# EasyEDA Pro project ProPrj_nrf52833_LighthouseTag_2025-07-28.epro, schematic Schematic4
Create Date: 2025-05-14; Page Name: P1; Project Name: Magnetic robot_hkust_bi; Schematic Name: Schematic4; Update Date: 2025-05-18
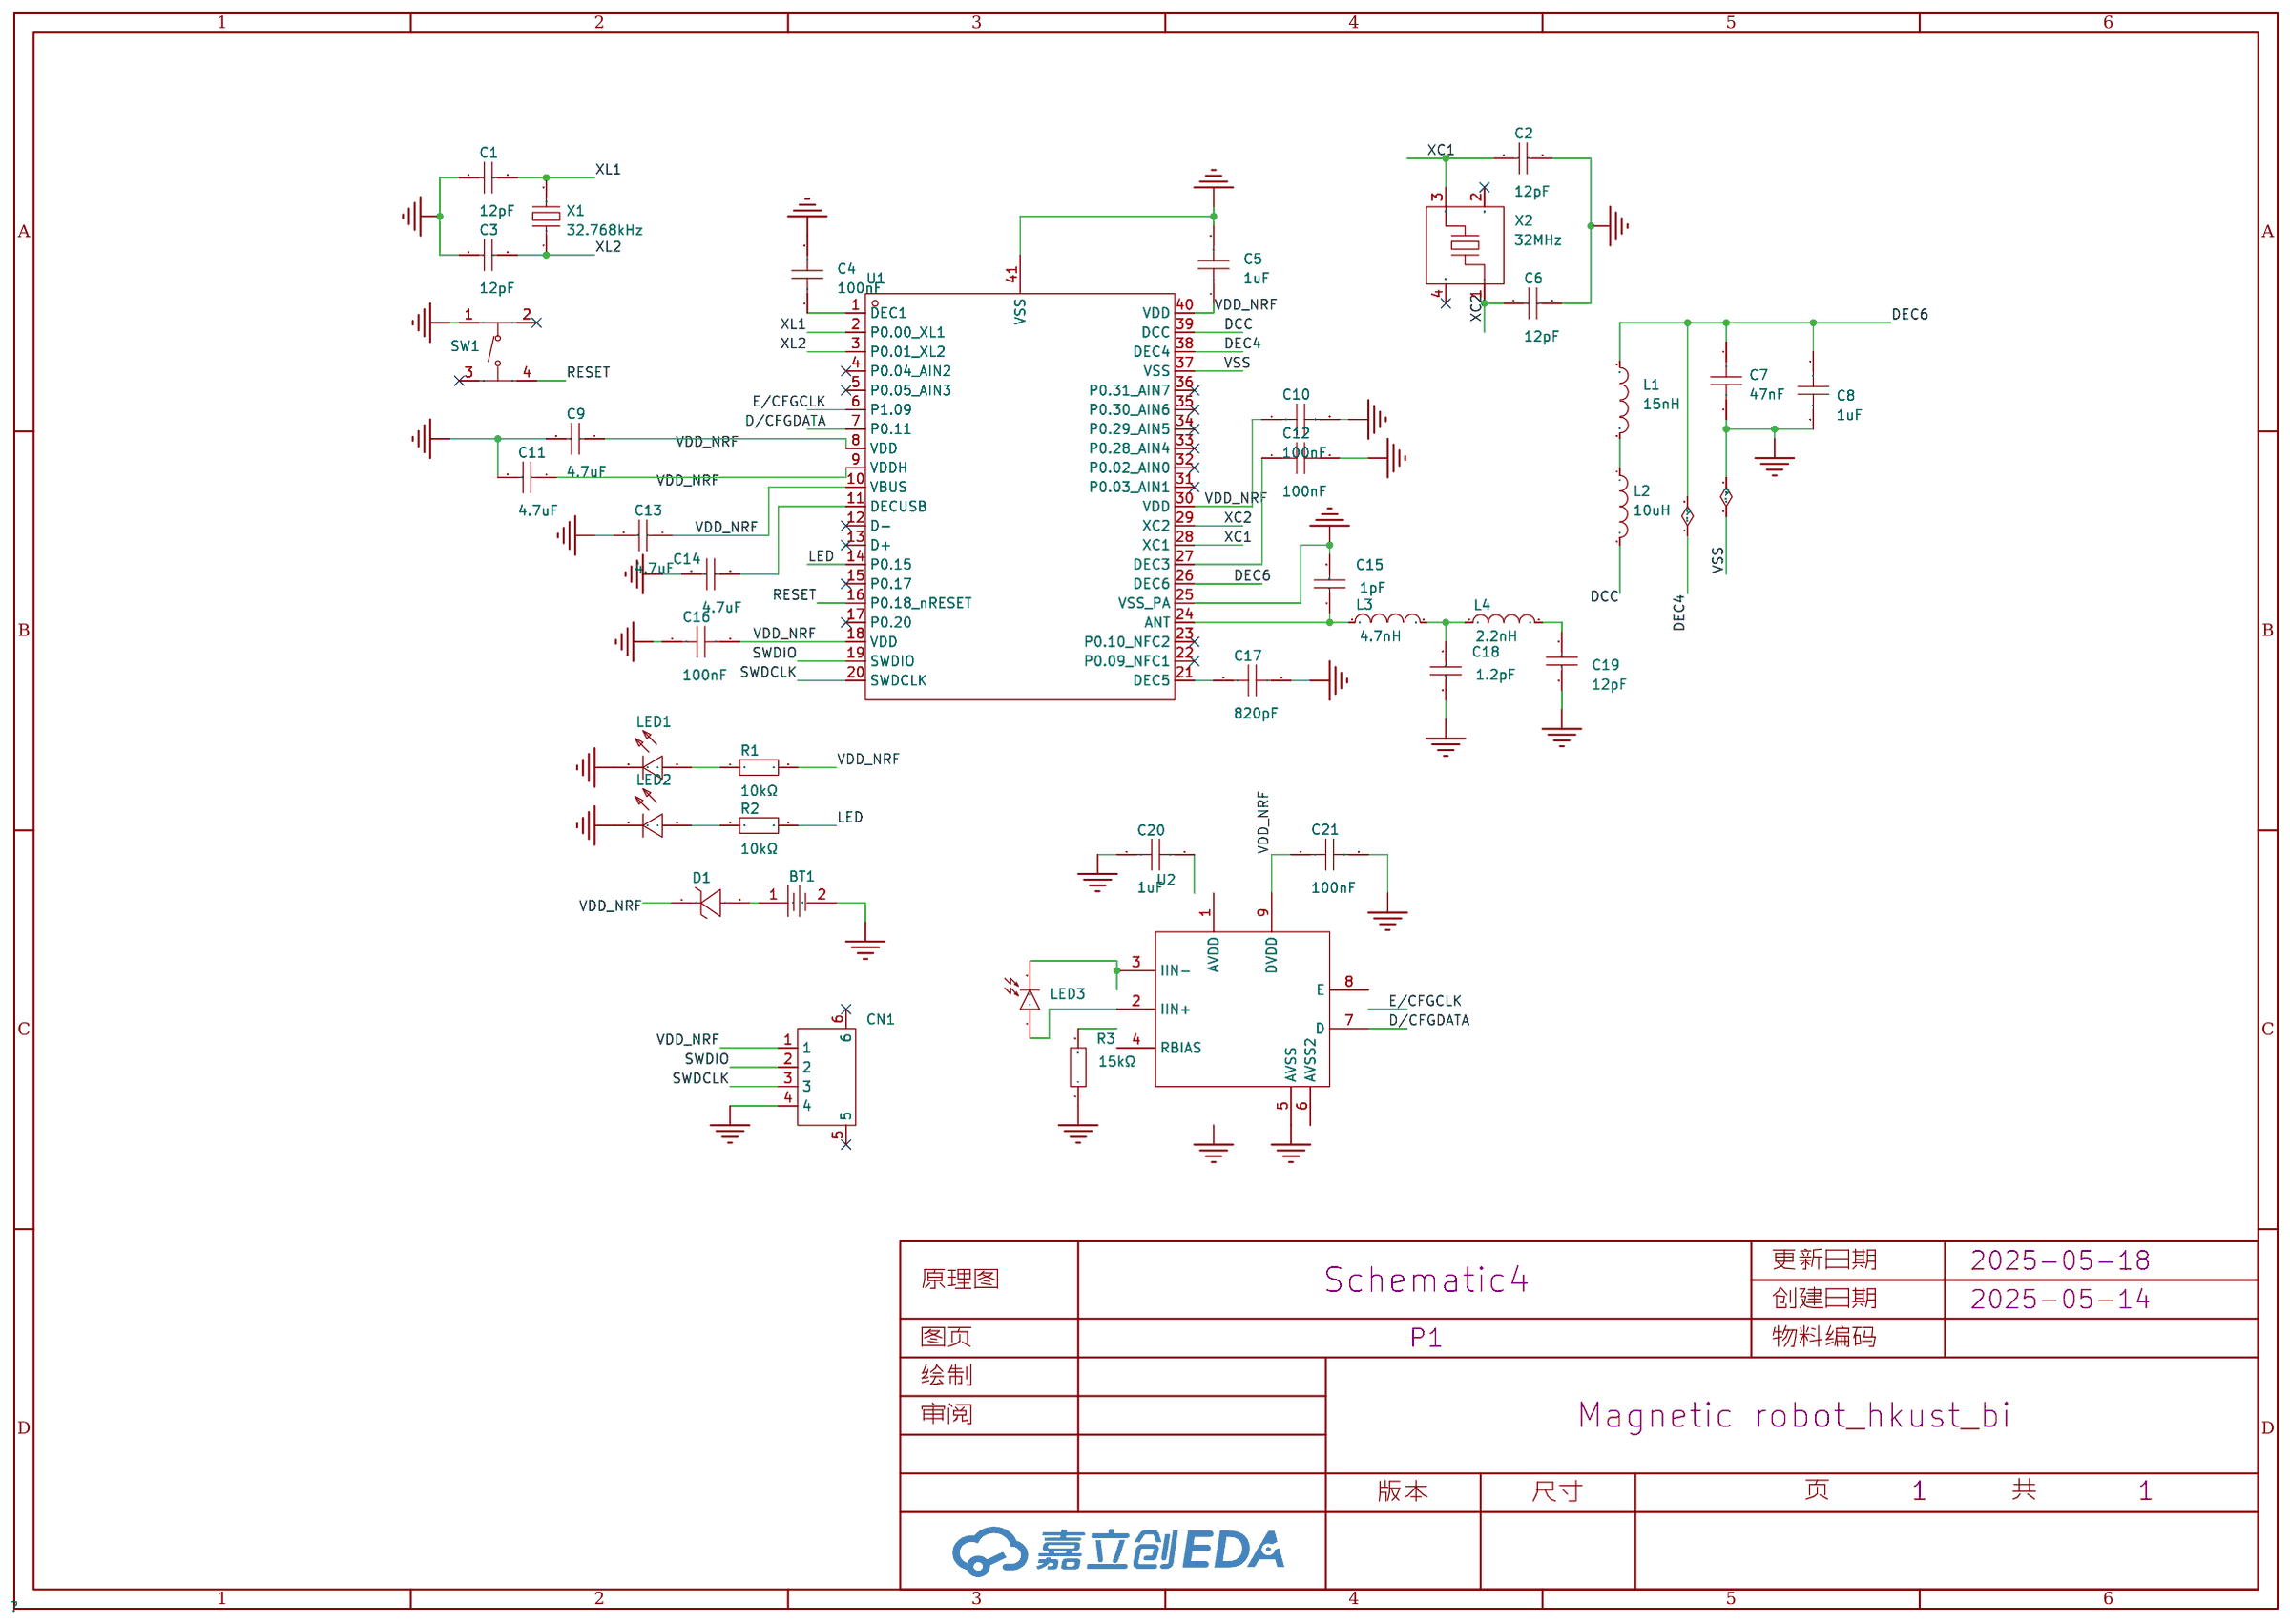
[diagram p0: schematic sheet]

## Parts
BT1  MY-927-01  [BAT-TH_MY-927-01]
C1  12pF  [C0402]
C2  12pF  [C0402]
C3  12pF  [C0402]
C4  100nF  [C0402]
C5  1uF  [C0402]
C6  12pF  [C0402]
C7  47nF  [C0402]
C8  1uF  [C0402]
C9  4.7uF  [C0402]
C10  100nF  [C0402]
C11  4.7uF  [C0402]
C12  100nF  [C0402]
C13  4.7uF  [C0402]
C14  4.7uF  [C0402]
C15  1pF  [C0402]
C16  100nF  [C0402]
C17  820pF  [C0402]
C18  1.2pF  [C0402]
C19  12pF  [C0402]
C20  1uF  [C0402]
C21  100nF  [C0402]
CN1  1.0-4PWB  [CONN-SMD_4P-P1.00_DEALON_1.0-4PWB]
D1  BZT52C3V3S  [SOD-323_L1.7-W1.3-LS2.6-RD]
L1  15nH  [IND-SMD_L1.0-W0.5-2]
L2  10uH  [IND-SMD_L2.5-W2.0]
L3  4.7nH  [IND-SMD_L1.0-W0.6]
L4  2.2nH  [IND-SMD_L1.0-W0.6]
LED1  NCD0603G1  [LED0603-RD_1]
LED2  NCD0603G1  [LED0603-RD_1]
LED3  VBPW34S  [SENSOR-SMD_L4.4-W3.9]
R1  10kΩ  [R0402]
R2  10kΩ  [R0402]
R3  15kΩ  [R0402]
SW1  TS-1187A-B-A-B  [SW-SMD_4P-L5.1-W5.1-P3.70-LS6.5-TL_H1.5]
U1  nRF52833-QDAA-R  [QFN-40_L5.0-W5.0-P0.40-TL-EP3.6]
U2  -  [TS4231]
X1  32.768kHz  [OSC-SMD_L3.2-W1.5]
X2  32MHz  [CRYSTAL-SMD_4P-L2.0-W1.6-BL-2]

## Library data of the parts
BT1 = MY-927-01: 连接器类型:电池扣;适用电池规格:CR927;触头材质:锰钢;触点电镀:镍;工作温度范围:-25~+85;; LCSC Part Name: 电池扣 适用电池:CR927; Supplier Part: C964850; Manufacturer: MYOUNG(美阳); Supplier Footprint: 插件; JLCPCB Part Class: Extended Part; Datasheet: https://atta.szlcsc.com/upload/public/pdf/source/20201218/C964850_48FDFDE1A9A12212C9EC07C1F9ECA79B.pdf; Supplier: LCSC; Connector Type: 电池扣; Battery Type: CR927; Contact Material: 锰钢; Contact Plating: 镍; Operating Temperature Range: -25~+85
C1-C3 C6 C19 = GRM1555C1H120JA01D: 容值:12pF;精度:±5%;额定电压:50V;温度系数:C0G;; LCSC Part Name: 12pF ±5% 50V; Supplier Part: C76948; Manufacturer: muRata(村田); Supplier Footprint: 0402; JLCPCB Part Class: Extended Part; Datasheet: https://atta.szlcsc.com/upload/public/pdf/source/20180307/C76948_15204091175261407736.pdf; Supplier: LCSC; Tolerance: ±5%; Voltage Rating: 50V; Temperature Coefficient: C0G
C4 C10 C12 C16 C21 = CL05B104KB54PNC: 容值:100nF;精度:±10%;额定电压:50V;材质(温度系数):X7R;; LCSC Part Name: 100nF ±10% 50V; Supplier Part: C307331; Manufacturer: SAMSUNG(三星); Supplier Footprint: 0402; JLCPCB Part Class: Basic Part; Datasheet: https://atta.szlcsc.com/upload/public/pdf/source/20160218/1457707763339.pdf; Supplier: LCSC; Tolerance: ±10%; Voltage Rated: 50V; Temperature Coefficient: X7R
C5 C8 C20 = CL05A105KA5NQNC: 容值:1uF;精度:±10%;额定电压:25V;材质(温度系数):X5R;; LCSC Part Name: 1uF ±10% 25V; Supplier Part: C52923; Manufacturer: SAMSUNG(三星); Supplier Footprint: 0402; JLCPCB Part Class: Basic Part; Datasheet: https://atta.szlcsc.com/upload/public/pdf/source/20160218/1457707763339.pdf; Supplier: LCSC; Tolerance: ±10%; Voltage Rated: 25V; Temperature Coefficient: X5R
C7 = CC0402KRX7R9BB473: 容值:47nF;精度:±10%;额定电压:50V;材质(温度系数):X7R;; LCSC Part Name: 47nF ±10% 50V; Supplier Part: C272875; Manufacturer: YAGEO(国巨); Supplier Footprint: 0402; JLCPCB Part Class: Extended Part; Datasheet: https://atta.szlcsc.com/upload/public/pdf/source/20181008/C309510_22F155564471FAF6A489F7D68F34234E.pdf; Supplier: LCSC; Tolerance: ±10%; Voltage Rated: 50V; Temperature Coefficient: X7R
C9 C11 C13 C14 = CL05A475MP5NRNC: 容值:4.7uF;精度:±20%;额定电压:10V;材质(温度系数):X5R;; LCSC Part Name: 4.7uF ±20% 10V; Supplier Part: C23733; Manufacturer: SAMSUNG(三星); Supplier Footprint: 0402; JLCPCB Part Class: Basic Part; Datasheet: https://atta.szlcsc.com/upload/public/pdf/source/20160218/1457707763339.pdf; Supplier: LCSC; Tolerance: ±20%; Voltage Rated: 10V; Temperature Coefficient: X5R
C15 = GJM1555C1H1R0WB01D: 容值:1pF;额定电压:50V;材质(温度系数):C0G;; LCSC Part Name: 1pF 50V ±0.05pF; Supplier Part: C72134; Manufacturer: muRata(村田); Supplier Footprint: 0402; JLCPCB Part Class: Extended Part; Datasheet: https://atta.szlcsc.com/upload/public/pdf/source/20161108/1478586454732.pdf; Supplier: LCSC; Voltage Rated: 50V; Temperature Coefficient: C0G
C17 = CC0402KRX7R9BB821: 容值:820pF;精度:±10%;额定电压:50V;材质(温度系数):X7R;; LCSC Part Name: 820pF ±10% 50V; Supplier Part: C107031; Manufacturer: YAGEO(国巨); Supplier Footprint: 0402; JLCPCB Part Class: Extended Part; Datasheet: https://atta.szlcsc.com/upload/public/pdf/source/20200803/C107031_D53C25CCCFEE93078DE0825CA32986C0.pdf; Supplier: LCSC; Tolerance: ±10%; Voltage Rated: 50V; Temperature Coefficient: X7R
C18 = GJM1555C1H1R2WB01D: 容值:1.2pF;额定电压:50V;材质(温度系数):C0G;; LCSC Part Name: 1.2pF 50V; Supplier Part: C76899; Manufacturer: muRata(村田); Supplier Footprint: 0402; JLCPCB Part Class: Extended Part; Datasheet: https://atta.szlcsc.com/upload/public/pdf/source/20180326/C76899_D46909C5BA6C0CCEF2691B3FE0C3732C.pdf; Supplier: LCSC; Voltage Rated: 50V; Temperature Coefficient: C0G
CN1 = 1.0-4PWB: 插针结构:1x4P;间距:1mm;安装方式:卧贴;参考系列:SH;总PIN数:4P;排数:1;每排PIN数:4;行距:-;额定电流:1A;触头材质:-;触头镀层:-;工作温度:-25~+85;; LCSC Part Name: 1x4P 间距:1mm 卧贴 系列:SH; Supplier Part: C2905006; Manufacturer: DEALON(德艺隆); Supplier Footprint: SMD,P=1mm,卧贴; JLCPCB Part Class: Extended Part; Datasheet: https://atta.szlcsc.com/upload/public/pdf/source/20211108/FAA45F8836A30651AE08A2D9A2D823F3.pdf; Supplier: LCSC; Pins Structure: 1x4P; Pitch: 1mm; Mounting Type: 卧贴; Reference Series: SH; Number of Pins: 4P; Number of Rows: 1; Number of PINs Per Row: 4; Current Rating: 1A; Operating Temperature: -25~+85; Voltage Rating: 50V; Supplementary Features: 辅助焊脚; Color: 米色; Z-Height of the Board: 2.9mm; X-Length of Bottom Edge on Board (Spacing Line): 6mm; Y-Width of Bottom Edge on Board: 5.03mm
D1 = BZT52C3V3S_C19077437: 二极管配置:独立式;稳压值(标称值):3.3V;稳压值(范围):3.1V~3.5V;功率(Pd):200mW;; Supplier Part: C19077437; Manufacturer: 宏迦橙; Supplier Footprint: SOD-323; JLCPCB Part Class: Extended Part; Datasheet: https://atta.szlcsc.com/upload/public/pdf/source/20231117/06CD1C2A69B3FFC97FEAE4263E1B2FE9.pdf; Supplier: LCSC; Diode Configuration: 独立式; Zener Voltage (Nom): 3.3V; Reverse Leakage Current (Ir): 5uA@1V; Zener Voltage (Range): 3.1V~3.5V; Power Dissipation: 200mW; Zener Impedance (Zzt): 95Ω
L1 = LQW15AN15NG00D: 电感值:15nH;精度:±2%;额定电流:460mA;饱和电流(Isat):-;; LCSC Part Name: 15nH ±2%; Supplier Part: C98055; Manufacturer: muRata(村田); Supplier Footprint: 0402; JLCPCB Part Class: Extended Part; Datasheet: https://atta.szlcsc.com/upload/public/pdf/source/20191016/C437364_463D6516B3BAE72B1DA0754F3D9B8308.pdf; Supplier: LCSC; Tolerance: ±2%; Rated Current: 460mA; DC Resistance (DCR): 160mΩ
L2 = FTC252012S100MBCA: 电感值:10uH;精度:±20%;额定电流:1.2A;饱和电流(Isat):1.6A;类型:一体成型电感;; LCSC Part Name: 10uH ±20% 1.6A; Supplier Part: C5832376; Manufacturer: cjiang(长江微电); Supplier Footprint: SMD,2x2.5mm; JLCPCB Part Class: Extended Part; Datasheet: https://atta.szlcsc.com/upload/public/pdf/source/20230602/8FFEDA9C0247A92A0D4B67554BFE4091.pdf; Supplier: LCSC; Tolerance: ±20%; Rated Current: 1.2A; Saturation Current (Isat): 1.6A; DC Resistance (DCR): 330mΩ; Type: 一体成型电感
L3 = LQW15AN4N7B00D: 电感值:4.7nH;额定电流:750mA;饱和电流(Isat):-;; Supplier Part: C98064; Manufacturer: muRata(村田); Supplier Footprint: 0402; JLCPCB Part Class: Extended Part; Datasheet: https://atta.szlcsc.com/upload/public/pdf/source/20191016/C437364_463D6516B3BAE72B1DA0754F3D9B8308.pdf; Supplier: LCSC; Rated Current: 750mA; DC Resistance (DCR): 70mΩ
L4 = LQW15AN2N2B80D: 电感值:2.2nH;额定电流:2.53A;饱和电流(Isat):-;; Supplier Part: C2041833; Manufacturer: muRata(村田); Supplier Footprint: 0402; JLCPCB Part Class: Extended Part; Datasheet: https://atta.szlcsc.com/upload/public/pdf/source/20210504/828CF85BF1F050871A8563B8C7472C90.pdf; Supplier: LCSC; Rated Current: 2.53A; DC Resistance (DCR): 22mΩ
LED1 LED2 = NCD0603G1: 发光颜色:翠绿色;正向压降(Vf):2.6V~3.6V;功率:72mW;正向电流:20mA;波长:515nm~530nm;透镜颜色:-;发光强度:330mcd~900mcd;发光角度:130°;工作温度:-30~+85;; Supplier Part: C84267; Manufacturer: 国星光电; Supplier Footprint: 0603; JLCPCB Part Class: Extended Part; Datasheet: https://atta.szlcsc.com/upload/public/pdf/source/20200820/C84267_04BA7703640BAC111D09F5EFB971FBF3.pdf; Supplier: LCSC; Illumination Color: 翠绿色; Voltage - Forward(Vf): 2.6V~3.6V; Power(Watts): 72mW; Forward Current: 20mA; Wavelength - Dominant: 515nm~530nm; Luminous Intensity: 330mcd~900mcd; Viewing Angle: 130°; Operating Temperature: -30~+85
LED3 = VBPW34S: 反向电压:60V;接收角:-;峰值波长:940nm;频谱范围:430nm~1100nm;暗电流:2nA;; LCSC Part Name: 940nm 频谱范围430nm~1100nm 反向电压60V; Supplier Part: C145262; Manufacturer: VISHAY(威世); Supplier Footprint: SMD,3.9x4.4mm; JLCPCB Part Class: Extended Part; Datasheet: https://atta.szlcsc.com/upload/public/pdf/source/20171211/C145262_15129614507721174601.pdf; Supplier: LCSC; DC Reverse Voltage: 60V; Peak  Wavelength: 940nm; Spectral Range: 430nm~1100nm; Current Dark: 2nA; Operating Temperature: -40~+100
R1 R2 = 0402WGF1002TCE: 电阻类型:厚膜电阻;阻值:10kΩ;精度:±1%;功率:62.5mW;最大工作电压:50V;温度系数:±100ppm/;; LCSC Part Name: 10kΩ ±1% 62.5mW 厚膜电阻; Supplier Part: C25744; Manufacturer: UNI-ROYAL(厚声); Supplier Footprint: 0402; JLCPCB Part Class: Basic Part; Datasheet: https://atta.szlcsc.com/upload/public/pdf/source/20200306/C422600_1E6D84923E4A46A82E41ADD87F860B5C.pdf; Supplier: LCSC; Type: 厚膜电阻; Tolerance: ±1%; Power(Watts): 62.5mW; Overload Voltage (Max): 50V; Temperature Coefficient: ±100ppm/; Operating Temperature Range: -55~+155
R3 = 0402WGF1502TCE: 电阻类型:厚膜电阻;阻值:15kΩ;精度:±1%;功率:62.5mW;最大工作电压:50V;温度系数:±100ppm/;; LCSC Part Name: 15kΩ ±1% 62.5mW 厚膜电阻; Supplier Part: C25756; Manufacturer: UNI-ROYAL(厚声); Supplier Footprint: 0402; JLCPCB Part Class: Basic Part; Datasheet: https://atta.szlcsc.com/upload/public/pdf/source/20200306/C422600_1E6D84923E4A46A82E41ADD87F860B5C.pdf; Supplier: LCSC; Type: 厚膜电阻; Tolerance: ±1%; Power(Watts): 62.5mW; Overload Voltage (Max): 50V; Temperature Coefficient: ±100ppm/; Operating Temperature Range: -55~+155
SW1 = TS-1187A-B-A-B: 电路结构:单刀单掷;按钮形状:圆形按钮;作用力:160gf;安装方式:立贴;开关长度:5.1mm;开关宽度:5.1mm;开关高度:1.5mm;带支架:不带;触点电流:50mA;额定电压(DC):12V;绝缘电阻:-;带灯:无;机械寿命:10万次;; LCSC Part Name: 5.1*5.1*1.5mm 立贴 轻触开关; Supplier Part: C318884; Manufacturer: XKB Connectivity(中国星坤); Supplier Footprint: SMD; JLCPCB Part Class: Basic Part; Datasheet: https://atta.szlcsc.com/upload/public/pdf/source/20200227/C318890_053E50208A88A7BA1965D8746000774E.pdf; Supplier: LCSC; Circuit: 单刀单掷; Actuator Style: 圆形按钮; Operating Force: 160gf; Mounting Style: 立贴; Switch Length: 5.1mm; Switch Width: 5.1mm; Switch Height: 1.5mm; Strike Gundam: 不带; Contact Current: 50mA; Voltage Rating (DC): 12V; Actuator/Cap Color: 金色; With Lamp: 无; Mechanical Life: 10万次; Operating Temperature: -30~+85
U1 = nRF52833-QDAA-R: Supplier Part: C2895249; Manufacturer: NORDIC; Supplier Footprint: QFN-40-EP(5x5); JLCPCB Part Class: Extended Part; Datasheet: https://atta.szlcsc.com/upload/public/pdf/source/20220526/66538D94E2BF566AD23AAE4CF6584247.pdf; Supplier: LCSC
U2 = TS4231
X1 = X321532768KGD2SI: 晶振类型:贴片晶振;频率:32.768kHz;常温频差:±20ppm;外接负载电容:12.5pF;频率稳定度(全温):-;; LCSC Part Name: 32.768kHz ±20ppm 12.5pF; Supplier Part: C620155; Manufacturer: YXC(扬兴晶振); Supplier Footprint: SMD3215-2P; JLCPCB Part Class: Extended Part; Datasheet: https://atta.szlcsc.com/upload/public/pdf/source/20240329/3A7650FD985DD0DE85694D3785AB4916.pdf; Supplier: LCSC; Crystal Type: 贴片晶振; Normal temperature Frequency Tolerance: ±20ppm; External load capacitor: 12.5pF; Operating Temperature: -40~+85
X2 = X201632MOB4SI: 晶振类型:贴片晶振;频率:32MHz;常温频差:±10ppm;负载电容:12pF;频率稳定度:±20ppm;; LCSC Part Name: 32MHz ±10ppm 12pF; Supplier Part: C2682773; Manufacturer: YXC(扬兴晶振); Supplier Footprint: SMD2016-4P; JLCPCB Part Class: Extended Part; Datasheet: https://atta.szlcsc.com/upload/public/pdf/source/20240329/C26C9A15A73CBCFBF373B30A8E126750.pdf; Supplier: LCSC; Type: 贴片晶振; Normal temperature Frequency Tolerance: ±10ppm; Load Capacitance: 12pF; Frequency Stability: ±20ppm; Operating Temperature: -40~+85

## Nets
GND: BT1.2 C1.1 C2.2 C3.1 C4.2 C5.2 C6.2 C7.2 C8.2 C9.2 C10.2 C11.2 C12.2 C13.2 C14.1 C15.2 C16.1 C17.2 C18.1 C19.1 C20.1 C21.2 CN1.4 LED1.1(K) LED2.1(K) R3.1 SW1.1(A) U1.25(VSS_PA) U1.37(VSS) U1.41(VSS) U2.5(AVSS)
VDD_NRF: C5.1 C9.1 C10.1 C11.1 C13.1 C16.2 C21.1 CN1.1 D1.1(K) R1.2 U1.8(VDD) U1.9(VDDH) U1.10(VBUS) U1.18(VDD) U1.30(VDD) U1.40(VDD) U2.9(DVDD)
D/CFGDATA: U1.7(P0.11) U2.7(D)
DCC: L2.2 U1.39(DCC)
DEC4: C7.1 C8.1 L1.2 U1.26(DEC6) U1.38(DEC4)
E/CFGCLK: U1.6(P1.09)
LED: R2.2 U1.14(P0.15)
RESET: SW1.4(D) U1.16(P0.18_nRESET)
SWDCLK: CN1.3 U1.20(SWDCLK)
SWDIO: CN1.2 U1.19(SWDIO)
XC1: C2.1 U1.28(XC1) X2.3
XC2: C6.1 U1.29(XC2) X2.1
XL1: C1.2 U1.2(P0.00_XL1) X1.2
XL2: C3.2 U1.3(P0.01_XL2) X1.1
$1N1552: C14.2 U1.11(DECUSB)
$1N2289: C17.1 U1.21(DEC5)
$1N2530: C15.1 L3.1 U1.24(ANT)
$1N2985: C18.2 L3.2 L4.1
$1N3242: C19.2 L4.2
$1N3495: C12.1 U1.27(DEC3)
$1N6091: L1.1 L2.1
$1N11226: LED3.1(A) U2.2(IIN+)
$1N20837: BT1.1 D1.2(A)
$1N22902: LED2.2(A) R2.1
$1N23087: C4.1 U1.1(DEC1)
$1N23686: LED1.2(A) R1.1
Net-(LED3-2): LED3.2(C) U2.3(IIN-)

Not connected (* = marked no-connect by the designer): C20 2; CN1 5* 6*; R3 2; SW1 2(B)* 3(C)*; U1 4(P0.04_AIN2)* 5(P0.05_AIN3)* 12(D-)* 13(D+)* 15(P0.17)* 17(P0.20)* 22(P0.09_NFC1)* 23(P0.10_NFC2)* 31(P0.03_AIN1)* 32(P0.02_AIN0)* 33(P0.28_AIN4)* 34(P0.29_AIN5)* 35(P0.30_AIN6)* 36(P0.31_AIN7)*; U2 1(AVDD) 4(RBIAS) 6(AVSS2) 8(E); X2 2(GND)* 4(GND)*
